# EAGLE schematic untitled (EAGLE 9.6.2)
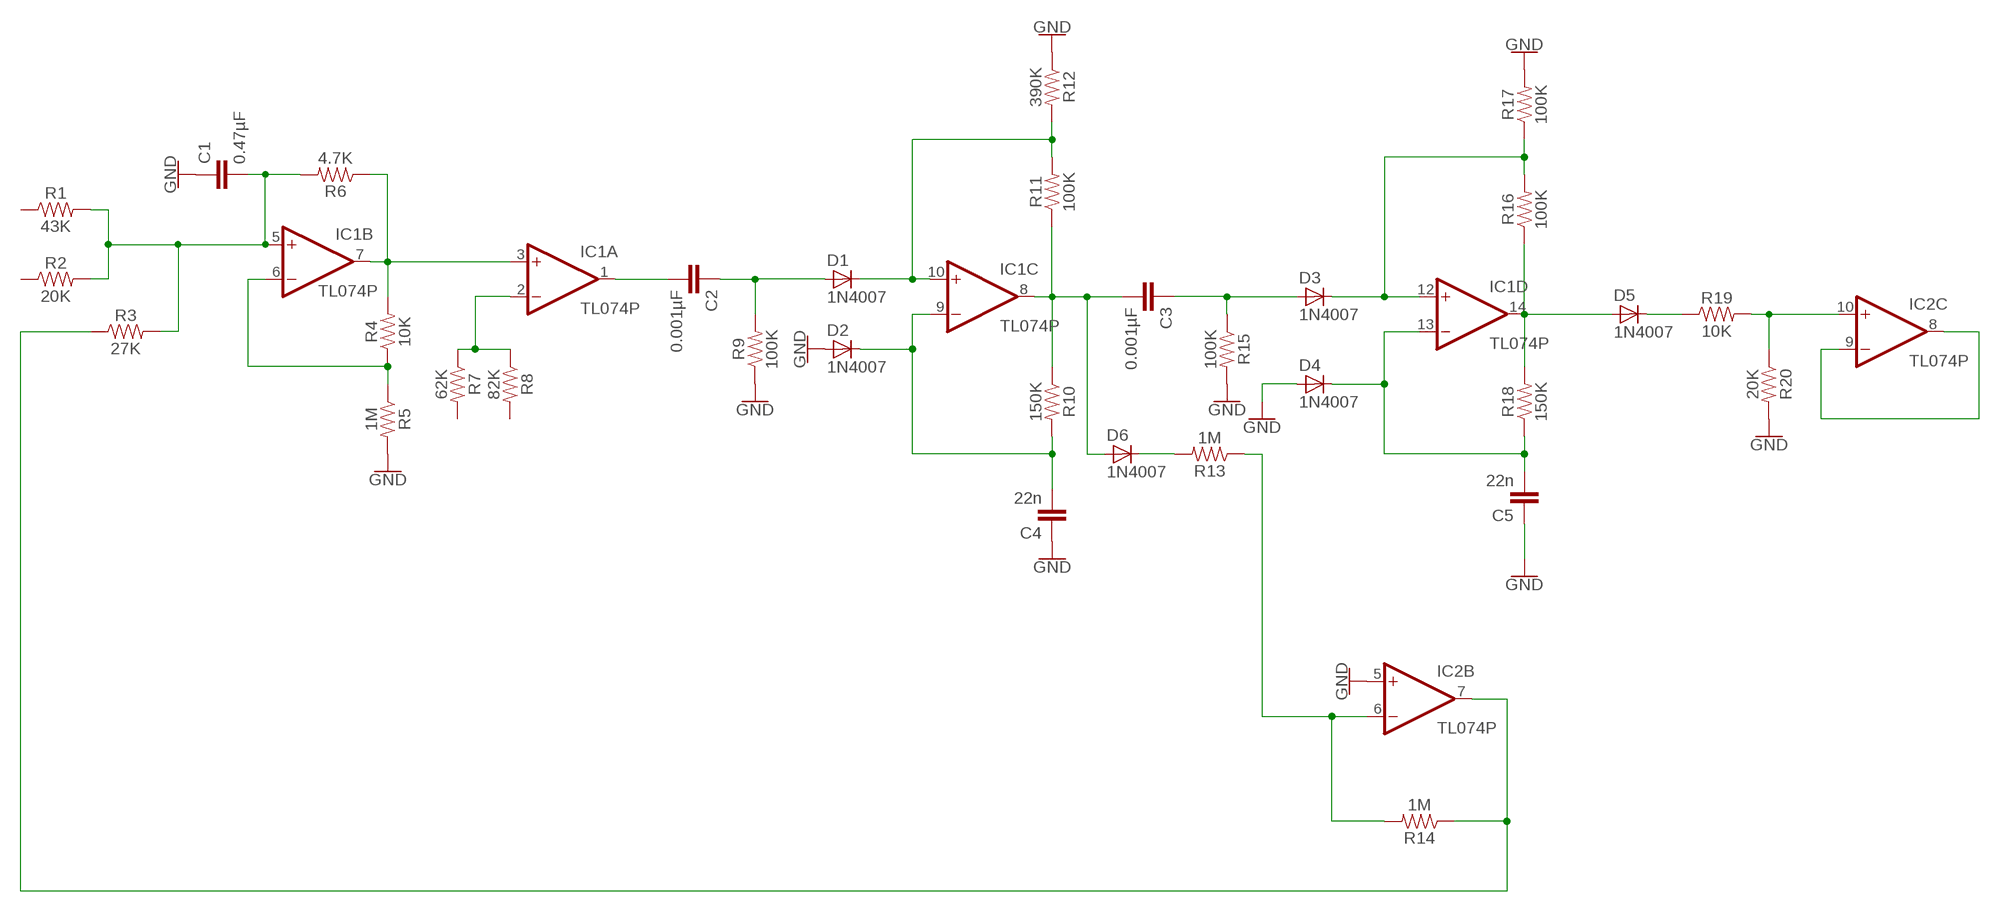
[diagram p0: schematic, sheet 1]

## Parts
C1  0.47µF  0.33UF/330NF-0805-50V-10%  [0805]
C2  0.001µF  0.33UF/330NF-0805-50V-10%  [0805]
C3  0.001µF  0.33UF/330NF-0805-50V-10%  [0805]
C4  22n  0.33UF/330NF-0805-50V-10%  [0805]
C5  22n  0.33UF/330NF-0805-50V-10%  [0805]
D1  1N4007  [SMA]
D2  1N4007  [SMA]
D3  1N4007  [SMA]
D4  1N4007  [SMA]
D5  1N4007  [SMA]
D6  1N4007  [SMA]
IC1  TL074P  [DIL14]
IC2  TL074P  [DIL14]
R1  43K  0.3OHM-0805-1/8W-1%  [0805]
R2  20K  0.3OHM-0805-1/8W-1%  [0805]
R3  27K  0.3OHM-0805-1/8W-1%  [0805]
R4  10K  0.3OHM-0805-1/8W-1%  [0805]
R5  1M  0.3OHM-0805-1/8W-1%  [0805]
R6  4.7K  0.3OHM-0805-1/8W-1%  [0805]
R7  62K  0.3OHM-0805-1/8W-1%  [0805]
R8  82K  0.3OHM-0805-1/8W-1%  [0805]
R9  100K  0.3OHM-0805-1/8W-1%  [0805]
R10  150K  0.3OHM-0805-1/8W-1%  [0805]
R11  100K  0.3OHM-0805-1/8W-1%  [0805]
R12  390K  0.3OHM-0805-1/8W-1%  [0805]
R13  1M  0.3OHM-0805-1/8W-1%  [0805]
R14  1M  0.3OHM-0805-1/8W-1%  [0805]
R15  100K  0.3OHM-0805-1/8W-1%  [0805]
R16  100K  0.3OHM-0805-1/8W-1%  [0805]
R17  100K  0.3OHM-0805-1/8W-1%  [0805]
R18  150K  0.3OHM-0805-1/8W-1%  [0805]
R19  10K  0.3OHM-0805-1/8W-1%  [0805]
R20  20K  0.3OHM-0805-1/8W-1%  [0805]

## Nets
GND: C1.1 C4.1 C5.1 D2.A D4.A IC2.5(B:+IN) R5.2 R9.1 R12.1 R15.2 R17.2 R20.2
N$1: C1.2 IC1.5(B:+IN) R1.2 R2.2 R3.2 R6.2
N$2: IC1.3(A:+IN) IC1.7(B:OUT) R4.2 R6.1
N$3: IC1.6(B:-IN) R4.1 R5.1
N$4: IC1.2(A:-IN) R7.1 R8.1
N$5: C2.2 IC1.1(A:OUT)
N$6: C2.1 D1.A R9.2
N$7: D1.K(C) IC1.10(C:+IN) R11.2 R12.2
N$8: C3.2 D6.A IC1.8(C:OUT) R10.1 R11.1
N$9: C4.2 D2.K(C) IC1.9(C:-IN) R10.2
N$10: C3.1 D3.A R15.1
N$11: C5.2 D4.K(C) IC1.13(D:-IN) R18.1
N$12: D5.A IC1.14(D:OUT) R16.1 R18.2
N$13: D3.K(C) IC1.12(D:+IN) R16.2 R17.1
N$16: D5.K(C) R19.1
N$17: IC2.10(C:+IN) R19.2 R20.1
N$18: IC2.8(C:OUT) IC2.9(C:-IN)
N$19: D6.K(C) R13.2
N$20: IC2.6(B:-IN) R13.1 R14.2
N$21: IC2.7(B:OUT) R3.1 R14.1
Unconnected: IC2.1(A:OUT) IC2.2(A:-IN) IC2.3(A:+IN) IC2.12(D:+IN) IC2.13(D:-IN) IC2.14(D:OUT) R1.1 R2.1 R7.2 R8.2

## Power pins joined to a net without a drawn wire
V+: IC1.4(P:V+) IC2.4(P:V+)
V-: IC1.11(P:V-) IC2.11(P:V-)

## Library data of the parts
C1-C5 = SparkFun-Capacitors:0.33UF/330NF: 0.33µF/330nF ceramic capacitors A capacitor is a passive two-terminal electrical component used to store electrical energy temporarily in an electric field.; PROD_ID: CAP-08469; VALUE: 0.33µF
D1-D6 = casovac:1N4007
IC1 IC2 = linear3:TL074: OP AMP
R1-R20 = SparkFun-Resistors:0.3OHM: 0.3Ω resistor A resistor is a passive two-terminal electrical component that implements electrical resistance as a circuit element. Resistors act to reduce current flow, and, at the same time, act to lower voltage levels within circuits. - Wikipedia; PROD_ID: RES-11622; VALUE: 0.3